# EAGLE design working (EAGLE 9.3.0)
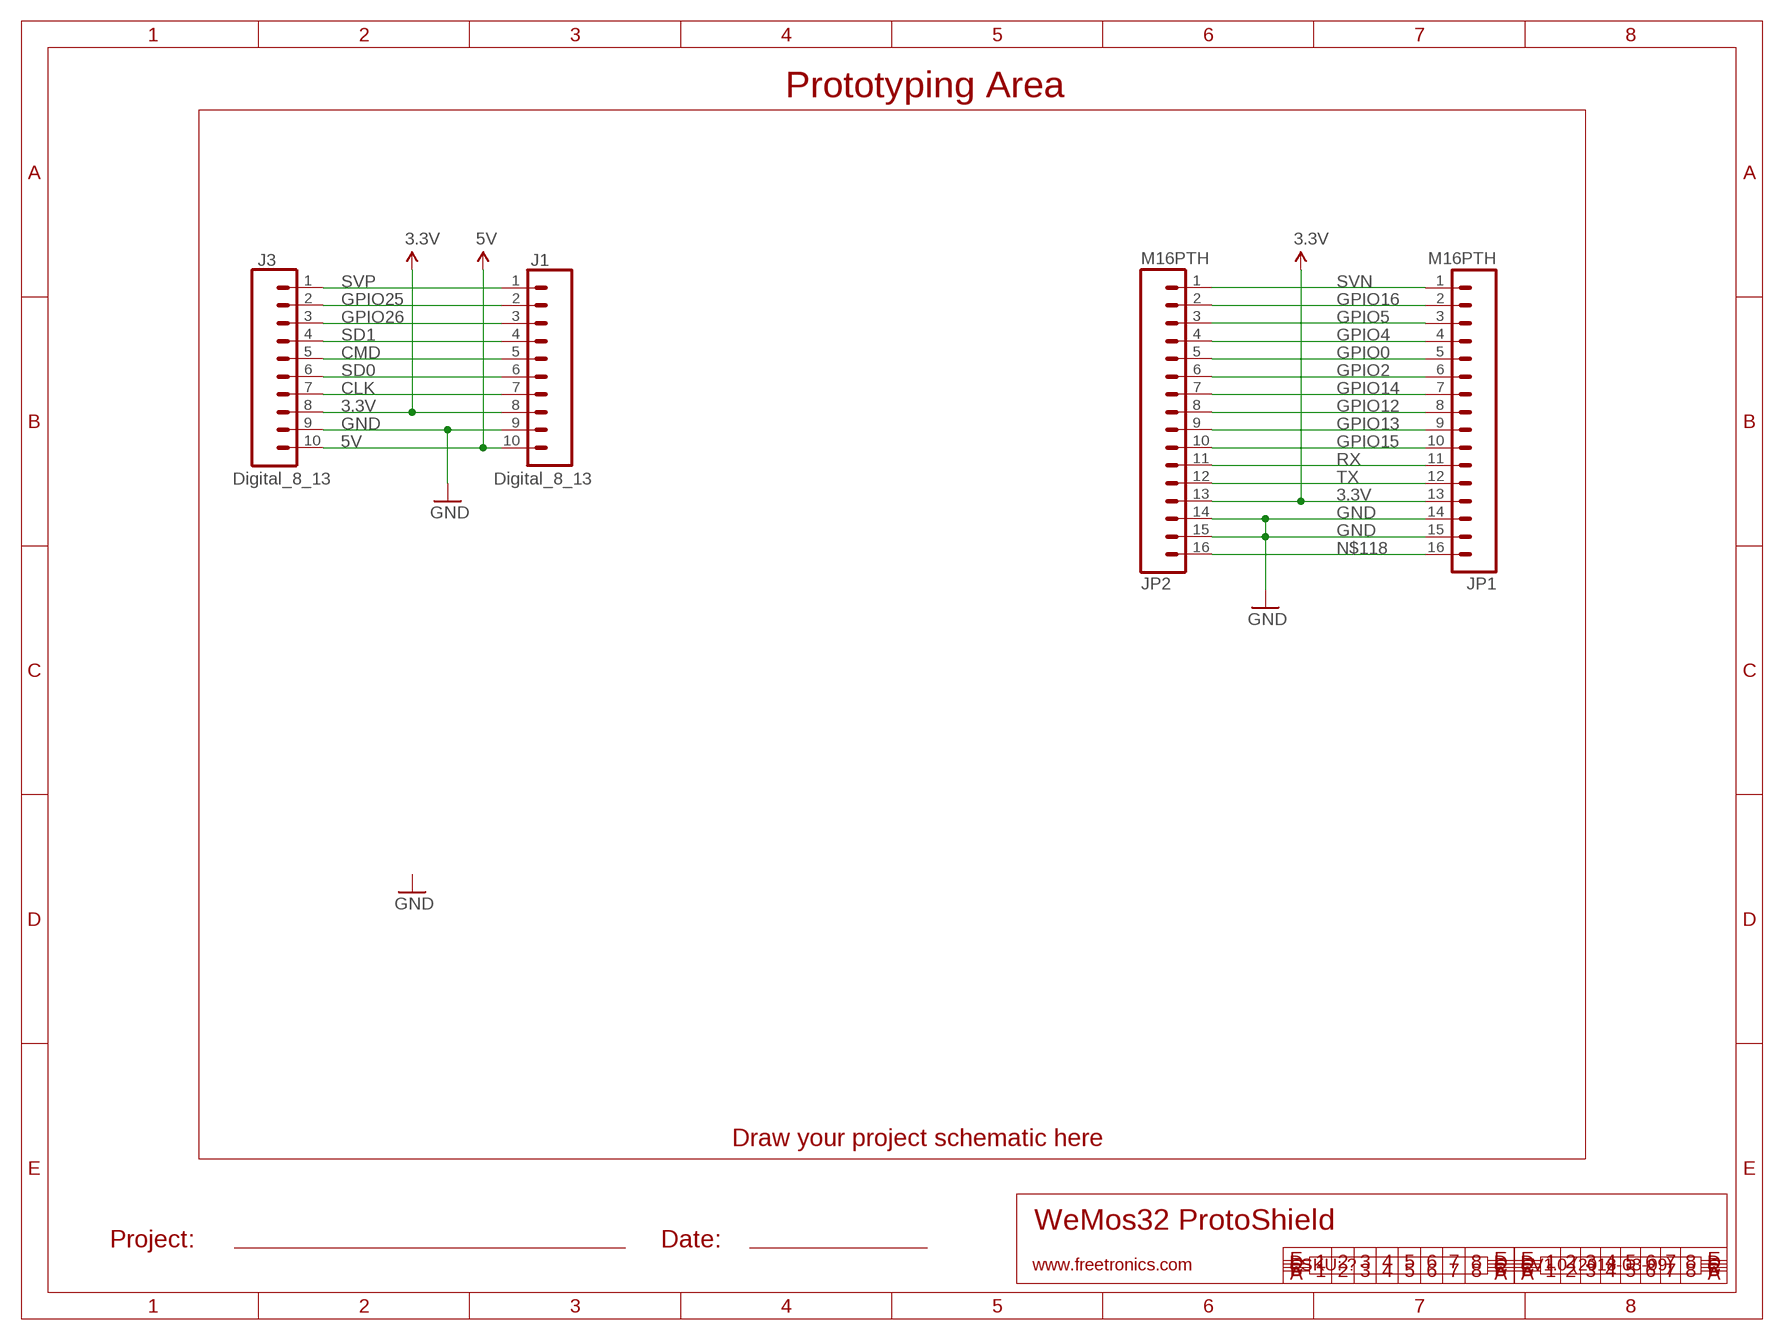
[diagram p0: schematic, sheet 1]

## Parts
J1  Digital_8_13  M100.1  [1X10]
J3  Digital_8_13  M100.1  [1X10]
JP1  M16PTH  [1X16]
JP2  M16PTH  [1X16]

## Nets
3.3V: J1.8 J3.8 JP1.13 JP2.13
5V: J1.10 J3.10
CLK: J1.7 J3.7
CMD: J1.5 J3.5
GND: J1.9 J3.9 JP1.14 JP1.15 JP2.14 JP2.15
GPIO0: JP1.5 JP2.5
GPIO2: JP1.6 JP2.6
GPIO4: JP1.4 JP2.4
GPIO5: JP1.3 JP2.3
GPIO12: JP1.8 JP2.8
GPIO13: JP1.9 JP2.9
GPIO14: JP1.7 JP2.7
GPIO15: JP1.10 JP2.10
GPIO16: JP1.2 JP2.2
GPIO25: J1.2 J3.2
GPIO26: J1.3 J3.3
N$118: JP1.16 JP2.16
RX: JP1.11 JP2.11
SD0: J1.6 J3.6
SD1: J1.4 J3.4
SVN: JP1.1 JP2.1
SVP: J1.1 J3.1
TX: JP1.12 JP2.12

## Notes on the sheet
- Prototyping Area
- Draw your project schematic here
- WeMos32 ProtoShield
- Project: | Date:
- www.freetronics.com | SKU: ? | V1.0 (2018-03-09)

## Library data of the parts
J1 J3 = freetronics-original:M10: Header 10 Standard 10-pin 0.1" header. Use with straight break away headers (SKU : PRT-00116), right angle break away headers (PRT-00553), swiss pins (PRT-00743), machine pins (PRT-00117), and female headers (PRT-00115).
JP1 JP2 = freetronics-jon:M16

## Board
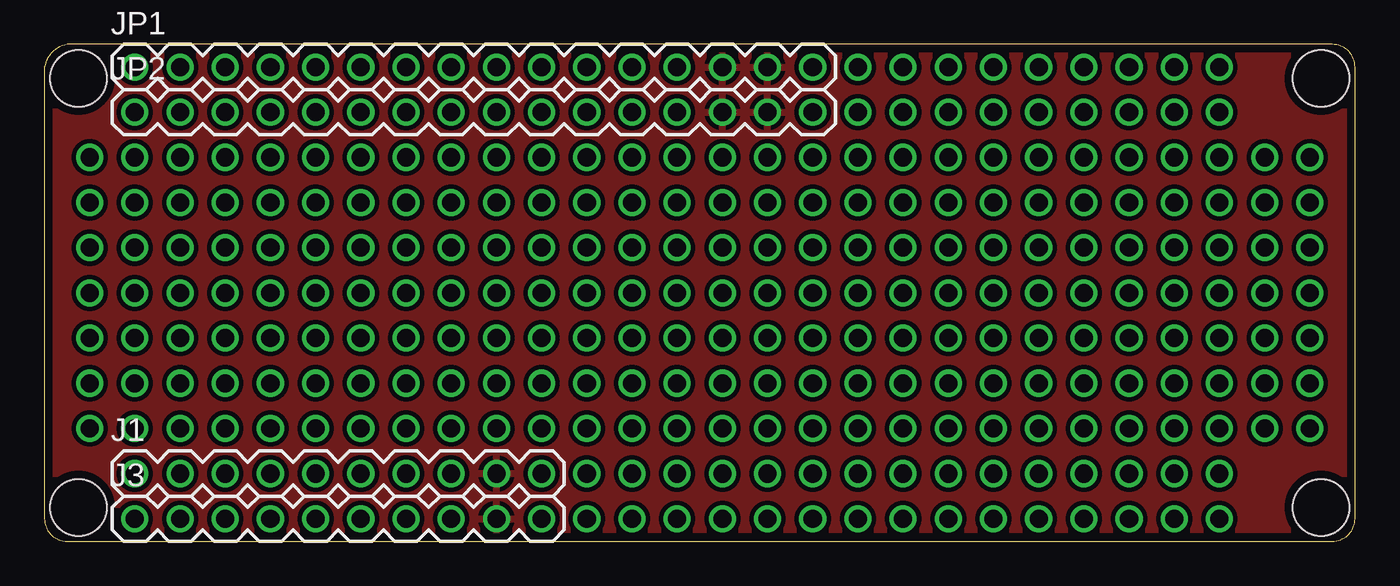
[diagram p1: board, top side]
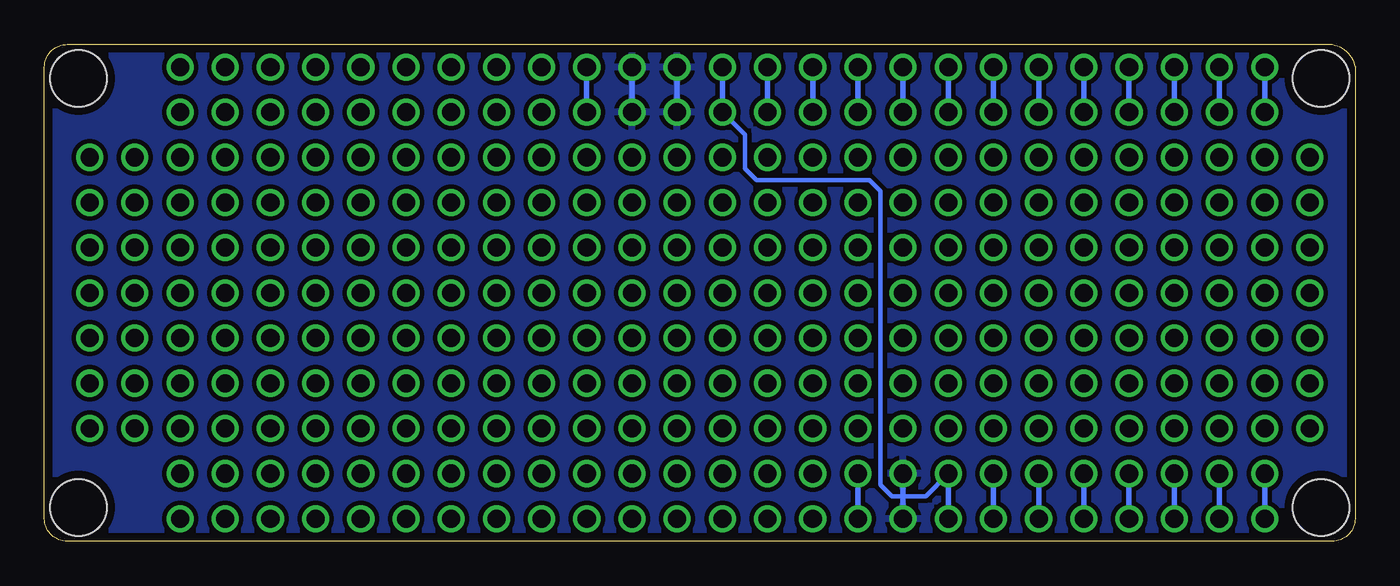
[diagram p2: board, bottom side, seen from below]

Size 73.66 x 27.94 mm. Coordinates in mm from the lower left corner, seen from the top.
Outline: 0,1.27 arc90 1.27,0 72.39,0 arc90 73.66,1.27 73.66,26.67 arc90 72.39,27.94 1.27,27.94 arc70 0,26.67 0,1.27
Copper layers (1*16): Top 0.035mm / dielectric 1.5mm / Bottom 0.035mm
Design rules "default *": minimum track width 10mil, minimum drill 24mil, track to track 10mil, track to pad 10mil, pad to pad 10mil, via to via 10mil, smd to smd 8mil, copper to edge 18mil, drill to drill 8mil, minimum pad ring 10mil, minimum via ring 8mil, stop-mask expansion 4mil, vias tented up to drill 0mil, thermal gap 10mil
Holes 3.17 mm at 1.91,26.04 1.91,1.91 71.75,1.91 71.75,26.04

### Footprints (pad centres in the part's own frame; a part is rotated, then mirrored left to right if it is on the bottom)
1X10 = drill 1.016: 1 0,0; 2 2.54,0; 3 5.08,0; 4 7.62,0; 5 10.16,0; 6 12.7,0; 7 15.24,0; 8 17.78,0; 9 20.32,0; 10 22.86,0
1X16 = drill 1.016: 1 0,0; 2 2.54,0; 3 5.08,0; 4 7.62,0; 5 10.16,0; 6 12.7,0; 7 15.24,0; 8 17.78,0; 9 20.32,0; 10 22.86,0; 11 25.4,0; 12 27.94,0; 13 30.48,0; 14 33.02,0; 15 35.56,0; 16 38.1,0

### Placement (x,y rotation side)
J1  5.08,3.81 0 top
J3  5.08,1.27 0 top
JP1  5.08,26.67 0 top
JP2  5.08,24.13 0 top

### Tracks (layer width: path | path; a pad name or v marks a point on that pad's centre or on a via)
3.3V
  Bottom 0.254: JP2.13 34.29,22.86 34.29,20.95 33.66,20.32 27.3,20.32 26.67,19.68 26.67,3.17 26.04,2.54 24.13,2.54 J1.8
  Bottom 0.305: J1.8 J3.8 | JP1.13 JP2.13
5V
  Bottom 0.305: J1.10 J3.10
CLK
  Bottom 0.305: J1.7 J3.7
CMD
  Bottom 0.305: J1.5 J3.5
GND
  Bottom 0.305: J1.9 J3.9 | JP1.15 JP2.15 | JP1.14 JP2.14
  pour Bottom: 0,26.67 arc-90 1.27,27.94 72.39,27.94 arc-90 73.66,26.67 73.66,1.27 arc-90 72.39,0 1.27,0 arc-90 0,1.27
  pour Top: 0,26.67 arc-90 1.27,27.94 72.39,27.94 arc-90 73.66,26.67 73.66,1.27 arc-90 72.39,0 1.27,0 arc-90 0,1.27
GPIO0
  Bottom 0.305: JP1.5 JP2.5
GPIO2
  Bottom 0.305: JP1.6 JP2.6
GPIO4
  Bottom 0.305: JP1.4 JP2.4
GPIO5
  Bottom 0.305: JP1.3 JP2.3
GPIO12
  Bottom 0.305: JP1.8 JP2.8
GPIO13
  Bottom 0.305: JP1.9 JP2.9
GPIO14
  Bottom 0.305: JP1.7 JP2.7
GPIO15
  Bottom 0.305: JP1.10 JP2.10
GPIO16
  Bottom 0.305: JP1.2 JP2.2
GPIO25
  Bottom 0.305: J1.2 J3.2
GPIO26
  Bottom 0.305: J1.3 J3.3
N$1  (via drill 1.02)
  other vias: 43.18,16.51
N$2  (via drill 1.02)
  other vias: 40.64,16.51
N$3  (via drill 1.02)
  other vias: 43.18,19.05
N$4  (via drill 1.02)
  other vias: 40.64,19.05
N$5  (via drill 1.02)
  other vias: 43.18,6.35
N$6  (via drill 1.02)
  other vias: 43.18,21.59
N$7  (via drill 1.02)
  other vias: 40.64,6.35
N$8  (via drill 1.02)
  other vias: 38.1,6.35
N$9  (via drill 1.02)
  other vias: 35.56,6.35
N$10  (via drill 1.02)
  other vias: 33.02,6.35
N$11  (via drill 1.02)
  other vias: 30.48,6.35
N$12  (via drill 1.02)
  other vias: 27.94,6.35
N$13  (via drill 1.02)
  other vias: 25.4,6.35
N$14  (via drill 1.02)
  other vias: 22.86,6.35
N$15  (via drill 1.02)
  other vias: 20.32,6.35
N$16  (via drill 1.02)
  other vias: 17.78,6.35
N$17  (via drill 1.02)
  other vias: 15.24,6.35
N$18  (via drill 1.02)
  other vias: 12.7,6.35
N$19  (via drill 1.02)
  other vias: 10.16,6.35
N$20  (via drill 1.02)
  other vias: 40.64,21.59
N$21  (via drill 1.02)
  other vias: 7.62,6.35
N$22  (via drill 1.02)
  other vias: 43.18,8.89
N$23  (via drill 1.02)
  other vias: 40.64,8.89
N$24  (via drill 1.02)
  other vias: 38.1,8.89
N$25  (via drill 1.02)
  other vias: 35.56,8.89
N$26  (via drill 1.02)
  other vias: 33.02,8.89
N$27  (via drill 1.02)
  other vias: 30.48,8.89
N$28  (via drill 1.02)
  other vias: 27.94,8.89
N$29  (via drill 1.02)
  other vias: 25.4,8.89
N$30  (via drill 1.02)
  other vias: 22.86,8.89
N$31  (via drill 1.02)
  other vias: 20.32,8.89
N$32  (via drill 1.02)
  other vias: 17.78,8.89
N$33  (via drill 1.02)
  other vias: 15.24,8.89
N$34  (via drill 1.02)
  other vias: 12.7,8.89
N$35  (via drill 1.02)
  other vias: 10.16,8.89
N$36  (via drill 1.02)
  other vias: 5.08,6.35
N$37  (via drill 1.02)
  other vias: 2.54,6.35
N$38  (via drill 1.02)
  other vias: 43.18,11.43
N$39  (via drill 1.02)
  other vias: 40.64,11.43
N$40  (via drill 1.02)
  other vias: 38.1,11.43
N$41  (via drill 1.02)
  other vias: 35.56,11.43
N$42  (via drill 1.02)
  other vias: 33.02,11.43
N$43  (via drill 1.02)
  other vias: 30.48,11.43
N$44  (via drill 1.02)
  other vias: 27.94,11.43
N$45  (via drill 1.02)
  other vias: 25.4,11.43
N$46  (via drill 1.02)
  other vias: 22.86,11.43
N$47  (via drill 1.02)
  other vias: 20.32,11.43
N$48  (via drill 1.02)
  other vias: 17.78,11.43
N$49  (via drill 1.02)
  other vias: 15.24,11.43
N$50  (via drill 1.02)
  other vias: 12.7,11.43
N$51  (via drill 1.02)
  other vias: 10.16,11.43
N$52  (via drill 1.02)
  other vias: 7.62,8.89
N$53  (via drill 1.02)
  other vias: 5.08,8.89
N$54  (via drill 1.02)
  other vias: 43.18,13.97
N$55  (via drill 1.02)
  other vias: 40.64,13.97
N$56  (via drill 1.02)
  other vias: 38.1,13.97
N$57  (via drill 1.02)
  other vias: 35.56,13.97
N$58  (via drill 1.02)
  other vias: 33.02,13.97
N$59  (via drill 1.02)
  other vias: 30.48,13.97
N$60  (via drill 1.02)
  other vias: 27.94,13.97
N$61  (via drill 1.02)
  other vias: 25.4,13.97
N$62  (via drill 1.02)
  other vias: 22.86,13.97
N$63  (via drill 1.02)
  other vias: 20.32,13.97
N$64  (via drill 1.02)
  other vias: 17.78,13.97
N$65  (via drill 1.02)
  other vias: 15.24,13.97
N$66  (via drill 1.02)
  other vias: 12.7,13.97
N$67  (via drill 1.02)
  other vias: 10.16,13.97
N$68  (via drill 1.02)
  other vias: 2.54,8.89
N$69  (via drill 1.02)
  other vias: 7.62,11.43
N$70  (via drill 1.02)
  other vias: 5.08,11.43
N$71  (via drill 1.02)
  other vias: 2.54,11.43
N$72  (via drill 1.02)
  other vias: 38.1,16.51
N$73  (via drill 1.02)
  other vias: 35.56,16.51
N$74  (via drill 1.02)
  other vias: 33.02,16.51
N$75  (via drill 1.02)
  other vias: 30.48,16.51
N$76  (via drill 1.02)
  other vias: 27.94,16.51
N$77  (via drill 1.02)
  other vias: 25.4,16.51
N$78  (via drill 1.02)
  other vias: 22.86,16.51
N$79  (via drill 1.02)
  other vias: 20.32,16.51
N$80  (via drill 1.02)
  other vias: 17.78,16.51
N$81  (via drill 1.02)
  other vias: 15.24,16.51
N$82  (via drill 1.02)
  other vias: 12.7,16.51
N$83  (via drill 1.02)
  other vias: 10.16,16.51
N$84  (via drill 1.02)
  other vias: 7.62,13.97
N$85  (via drill 1.02)
  other vias: 5.08,13.97
N$86  (via drill 1.02)
  other vias: 2.54,13.97
N$87  (via drill 1.02)
  other vias: 7.62,16.51
N$88  (via drill 1.02)
  other vias: 38.1,19.05
N$89  (via drill 1.02)
  other vias: 35.56,19.05
N$90  (via drill 1.02)
  other vias: 33.02,19.05
N$91  (via drill 1.02)
  other vias: 30.48,19.05
N$92  (via drill 1.02)
  other vias: 27.94,19.05
N$93  (via drill 1.02)
  other vias: 25.4,19.05
N$94  (via drill 1.02)
  other vias: 22.86,19.05
N$95  (via drill 1.02)
  other vias: 20.32,19.05
N$96  (via drill 1.02)
  other vias: 17.78,19.05
N$97  (via drill 1.02)
  other vias: 15.24,19.05
N$98  (via drill 1.02)
  other vias: 12.7,19.05
N$99  (via drill 1.02)
  other vias: 10.16,19.05
N$100  (via drill 1.02)
  other vias: 5.08,16.51
N$101  (via drill 1.02)
  other vias: 2.54,16.51
N$102  (via drill 1.02)
  other vias: 7.62,19.05
N$103  (via drill 1.02)
  other vias: 5.08,19.05
N$104  (via drill 1.02)
  other vias: 38.1,21.59
N$105  (via drill 1.02)
  other vias: 35.56,21.59
N$106  (via drill 1.02)
  other vias: 33.02,21.59
N$107  (via drill 1.02)
  other vias: 30.48,21.59
N$108  (via drill 1.02)
  other vias: 27.94,21.59
N$109  (via drill 1.02)
  other vias: 25.4,21.59
N$110  (via drill 1.02)
  other vias: 22.86,21.59
N$111  (via drill 1.02)
  other vias: 20.32,21.59
N$112  (via drill 1.02)
  other vias: 17.78,21.59
N$113  (via drill 1.02)
  other vias: 15.24,21.59
N$114  (via drill 1.02)
  other vias: 12.7,21.59
N$115  (via drill 1.02)
  other vias: 10.16,21.59
N$116  (via drill 1.02)
  other vias: 2.54,19.05
N$117  (via drill 1.02)
  other vias: 7.62,21.59
N$118
  Bottom 0.305: JP1.16 JP2.16
N$119  (via drill 1.02)
  other vias: 5.08,21.59
N$120  (via drill 1.02)
  other vias: 2.54,21.59
N$121  (via drill 1.02)
  other vias: 53.34,6.35
N$122  (via drill 1.02)
  other vias: 50.8,6.35
N$123  (via drill 1.02)
  other vias: 48.26,6.35
N$124  (via drill 1.02)
  other vias: 45.72,6.35
N$125  (via drill 1.02)
  other vias: 53.34,8.89
N$126  (via drill 1.02)
  other vias: 50.8,8.89
N$127  (via drill 1.02)
  other vias: 48.26,8.89
N$128  (via drill 1.02)
  other vias: 45.72,8.89
N$129  (via drill 1.02)
  other vias: 53.34,11.43
N$130  (via drill 1.02)
  other vias: 50.8,11.43
N$131  (via drill 1.02)
  other vias: 48.26,11.43
N$132  (via drill 1.02)
  other vias: 45.72,11.43
N$133  (via drill 1.02)
  other vias: 53.34,13.97
N$134  (via drill 1.02)
  other vias: 50.8,13.97
N$135  (via drill 1.02)
  other vias: 48.26,13.97
N$136  (via drill 1.02)
  other vias: 45.72,13.97
N$137  (via drill 1.02)
  other vias: 48.26,16.51
N$138  (via drill 1.02)
  other vias: 45.72,16.51
N$139  (via drill 1.02)
  other vias: 48.26,19.05
N$140  (via drill 1.02)
  other vias: 45.72,19.05
N$141  (via drill 1.02)
  other vias: 48.26,21.59
N$142  (via drill 1.02)
  other vias: 45.72,21.59
N$143  (via drill 1.02)
  other vias: 53.34,16.51
N$144  (via drill 1.02)
  other vias: 50.8,16.51
N$145  (via drill 1.02)
  other vias: 53.34,19.05
N$146  (via drill 1.02)
  other vias: 50.8,19.05
N$147  (via drill 1.02)
  other vias: 53.34,21.59
N$148  (via drill 1.02)
  other vias: 50.8,21.59
N$149  (via drill 1.02)
  other vias: 60.96,6.35
N$150  (via drill 1.02)
  other vias: 58.42,6.35
N$151  (via drill 1.02)
  other vias: 55.88,6.35
N$152  (via drill 1.02)
  other vias: 60.96,8.89
N$153  (via drill 1.02)
  other vias: 58.42,8.89
N$154  (via drill 1.02)
  other vias: 55.88,8.89
N$155  (via drill 1.02)
  other vias: 60.96,11.43
N$156  (via drill 1.02)
  other vias: 58.42,11.43
N$157  (via drill 1.02)
  other vias: 55.88,11.43
N$158  (via drill 1.02)
  other vias: 60.96,13.97
N$159  (via drill 1.02)
  other vias: 58.42,13.97
N$160  (via drill 1.02)
  other vias: 55.88,13.97
N$161  (via drill 1.02)
  other vias: 55.88,16.51
N$162  (via drill 1.02)
  other vias: 55.88,19.05
N$163  (via drill 1.02)
  other vias: 55.88,21.59
N$164  (via drill 1.02)
  other vias: 60.96,16.51
N$165  (via drill 1.02)
  other vias: 58.42,16.51
N$166  (via drill 1.02)
  other vias: 60.96,19.05
N$167  (via drill 1.02)
  other vias: 58.42,19.05
N$168  (via drill 1.02)
  other vias: 60.96,21.59
N$169  (via drill 1.02)
  other vias: 58.42,21.59
N$170  (via drill 1.02)
  other vias: 71.12,6.35
N$171  (via drill 1.02)
  other vias: 68.58,6.35
N$172  (via drill 1.02)
  other vias: 66.04,6.35
N$173  (via drill 1.02)
  other vias: 63.5,6.35
N$174  (via drill 1.02)
  other vias: 71.12,8.89
N$175  (via drill 1.02)
  other vias: 68.58,8.89
N$176  (via drill 1.02)
  other vias: 66.04,8.89
N$177  (via drill 1.02)
  other vias: 63.5,8.89
N$178  (via drill 1.02)
  other vias: 71.12,11.43
N$179  (via drill 1.02)
  other vias: 68.58,11.43
N$180  (via drill 1.02)
  other vias: 66.04,11.43
N$181  (via drill 1.02)
  other vias: 63.5,11.43
N$182  (via drill 1.02)
  other vias: 71.12,13.97
N$183  (via drill 1.02)
  other vias: 68.58,13.97
N$184  (via drill 1.02)
  other vias: 66.04,13.97
N$185  (via drill 1.02)
  other vias: 63.5,13.97
N$186  (via drill 1.02)
  other vias: 66.04,16.51
N$187  (via drill 1.02)
  other vias: 63.5,16.51
N$188  (via drill 1.02)
  other vias: 66.04,19.05
N$189  (via drill 1.02)
  other vias: 63.5,19.05
N$190  (via drill 1.02)
  other vias: 66.04,21.59
N$191  (via drill 1.02)
  other vias: 63.5,21.59
N$192  (via drill 1.02)
  other vias: 71.12,16.51
N$193  (via drill 1.02)
  other vias: 68.58,16.51
N$194  (via drill 1.02)
  other vias: 71.12,19.05
N$195  (via drill 1.02)
  other vias: 68.58,19.05
N$196  (via drill 1.02)
  other vias: 71.12,21.59
N$197  (via drill 1.02)
  other vias: 68.58,21.59
N$198  (via drill 1.02)
  other vias: 48.26,24.13
N$199  (via drill 1.02)
  other vias: 45.72,24.13
N$200  (via drill 1.02)
  other vias: 48.26,26.67
N$201  (via drill 1.02)
  other vias: 45.72,26.67
N$202  (via drill 1.02)
  other vias: 53.34,24.13
N$203  (via drill 1.02)
  other vias: 50.8,24.13
N$204  (via drill 1.02)
  other vias: 53.34,26.67
N$205  (via drill 1.02)
  other vias: 50.8,26.67
N$206  (via drill 1.02)
  other vias: 55.88,24.13
N$207  (via drill 1.02)
  other vias: 55.88,26.67
N$208  (via drill 1.02)
  other vias: 60.96,24.13
N$209  (via drill 1.02)
  other vias: 58.42,24.13
N$210  (via drill 1.02)
  other vias: 60.96,26.67
N$211  (via drill 1.02)
  other vias: 58.42,26.67
N$212  (via drill 1.02)
  other vias: 66.04,24.13
N$213  (via drill 1.02)
  other vias: 63.5,24.13
N$214  (via drill 1.02)
  other vias: 66.04,26.67
N$215  (via drill 1.02)
  other vias: 63.5,26.67
N$216  (via drill 1.02)
  other vias: 43.18,1.27
N$217  (via drill 1.02)
  other vias: 40.64,1.27
N$218  (via drill 1.02)
  other vias: 38.1,1.27
N$219  (via drill 1.02)
  other vias: 35.56,1.27
N$220  (via drill 1.02)
  other vias: 33.02,1.27
N$221  (via drill 1.02)
  other vias: 30.48,1.27
N$222  (via drill 1.02)
  other vias: 43.18,3.81
N$223  (via drill 1.02)
  other vias: 40.64,3.81
N$224  (via drill 1.02)
  other vias: 38.1,3.81
N$225  (via drill 1.02)
  other vias: 35.56,3.81
N$226  (via drill 1.02)
  other vias: 33.02,3.81
N$227  (via drill 1.02)
  other vias: 30.48,3.81
N$228  (via drill 1.02)
  other vias: 53.34,1.27
N$229  (via drill 1.02)
  other vias: 50.8,1.27
N$230  (via drill 1.02)
  other vias: 48.26,1.27
N$231  (via drill 1.02)
  other vias: 45.72,1.27
N$232  (via drill 1.02)
  other vias: 53.34,3.81
N$233  (via drill 1.02)
  other vias: 50.8,3.81
N$234  (via drill 1.02)
  other vias: 48.26,3.81
N$235  (via drill 1.02)
  other vias: 45.72,3.81
N$236  (via drill 1.02)
  other vias: 60.96,1.27
N$237  (via drill 1.02)
  other vias: 58.42,1.27
N$238  (via drill 1.02)
  other vias: 55.88,1.27
N$239  (via drill 1.02)
  other vias: 60.96,3.81
N$240  (via drill 1.02)
  other vias: 58.42,3.81
N$241  (via drill 1.02)
  other vias: 55.88,3.81
N$242  (via drill 1.02)
  other vias: 66.04,1.27
N$243  (via drill 1.02)
  other vias: 63.5,1.27
N$244  (via drill 1.02)
  other vias: 66.04,3.81
N$245  (via drill 1.02)
  other vias: 63.5,3.81
RX
  Bottom 0.305: JP1.11 JP2.11
SD0
  Bottom 0.305: J1.6 J3.6
SD1
  Bottom 0.305: J1.4 J3.4
SVN
  Bottom 0.305: JP1.1 JP2.1
SVP
  Bottom 0.305: J1.1 J3.1
TX
  Bottom 0.305: JP1.12 JP2.12